# Altium project PCIE to MXM Riser Mini.PrjPcb
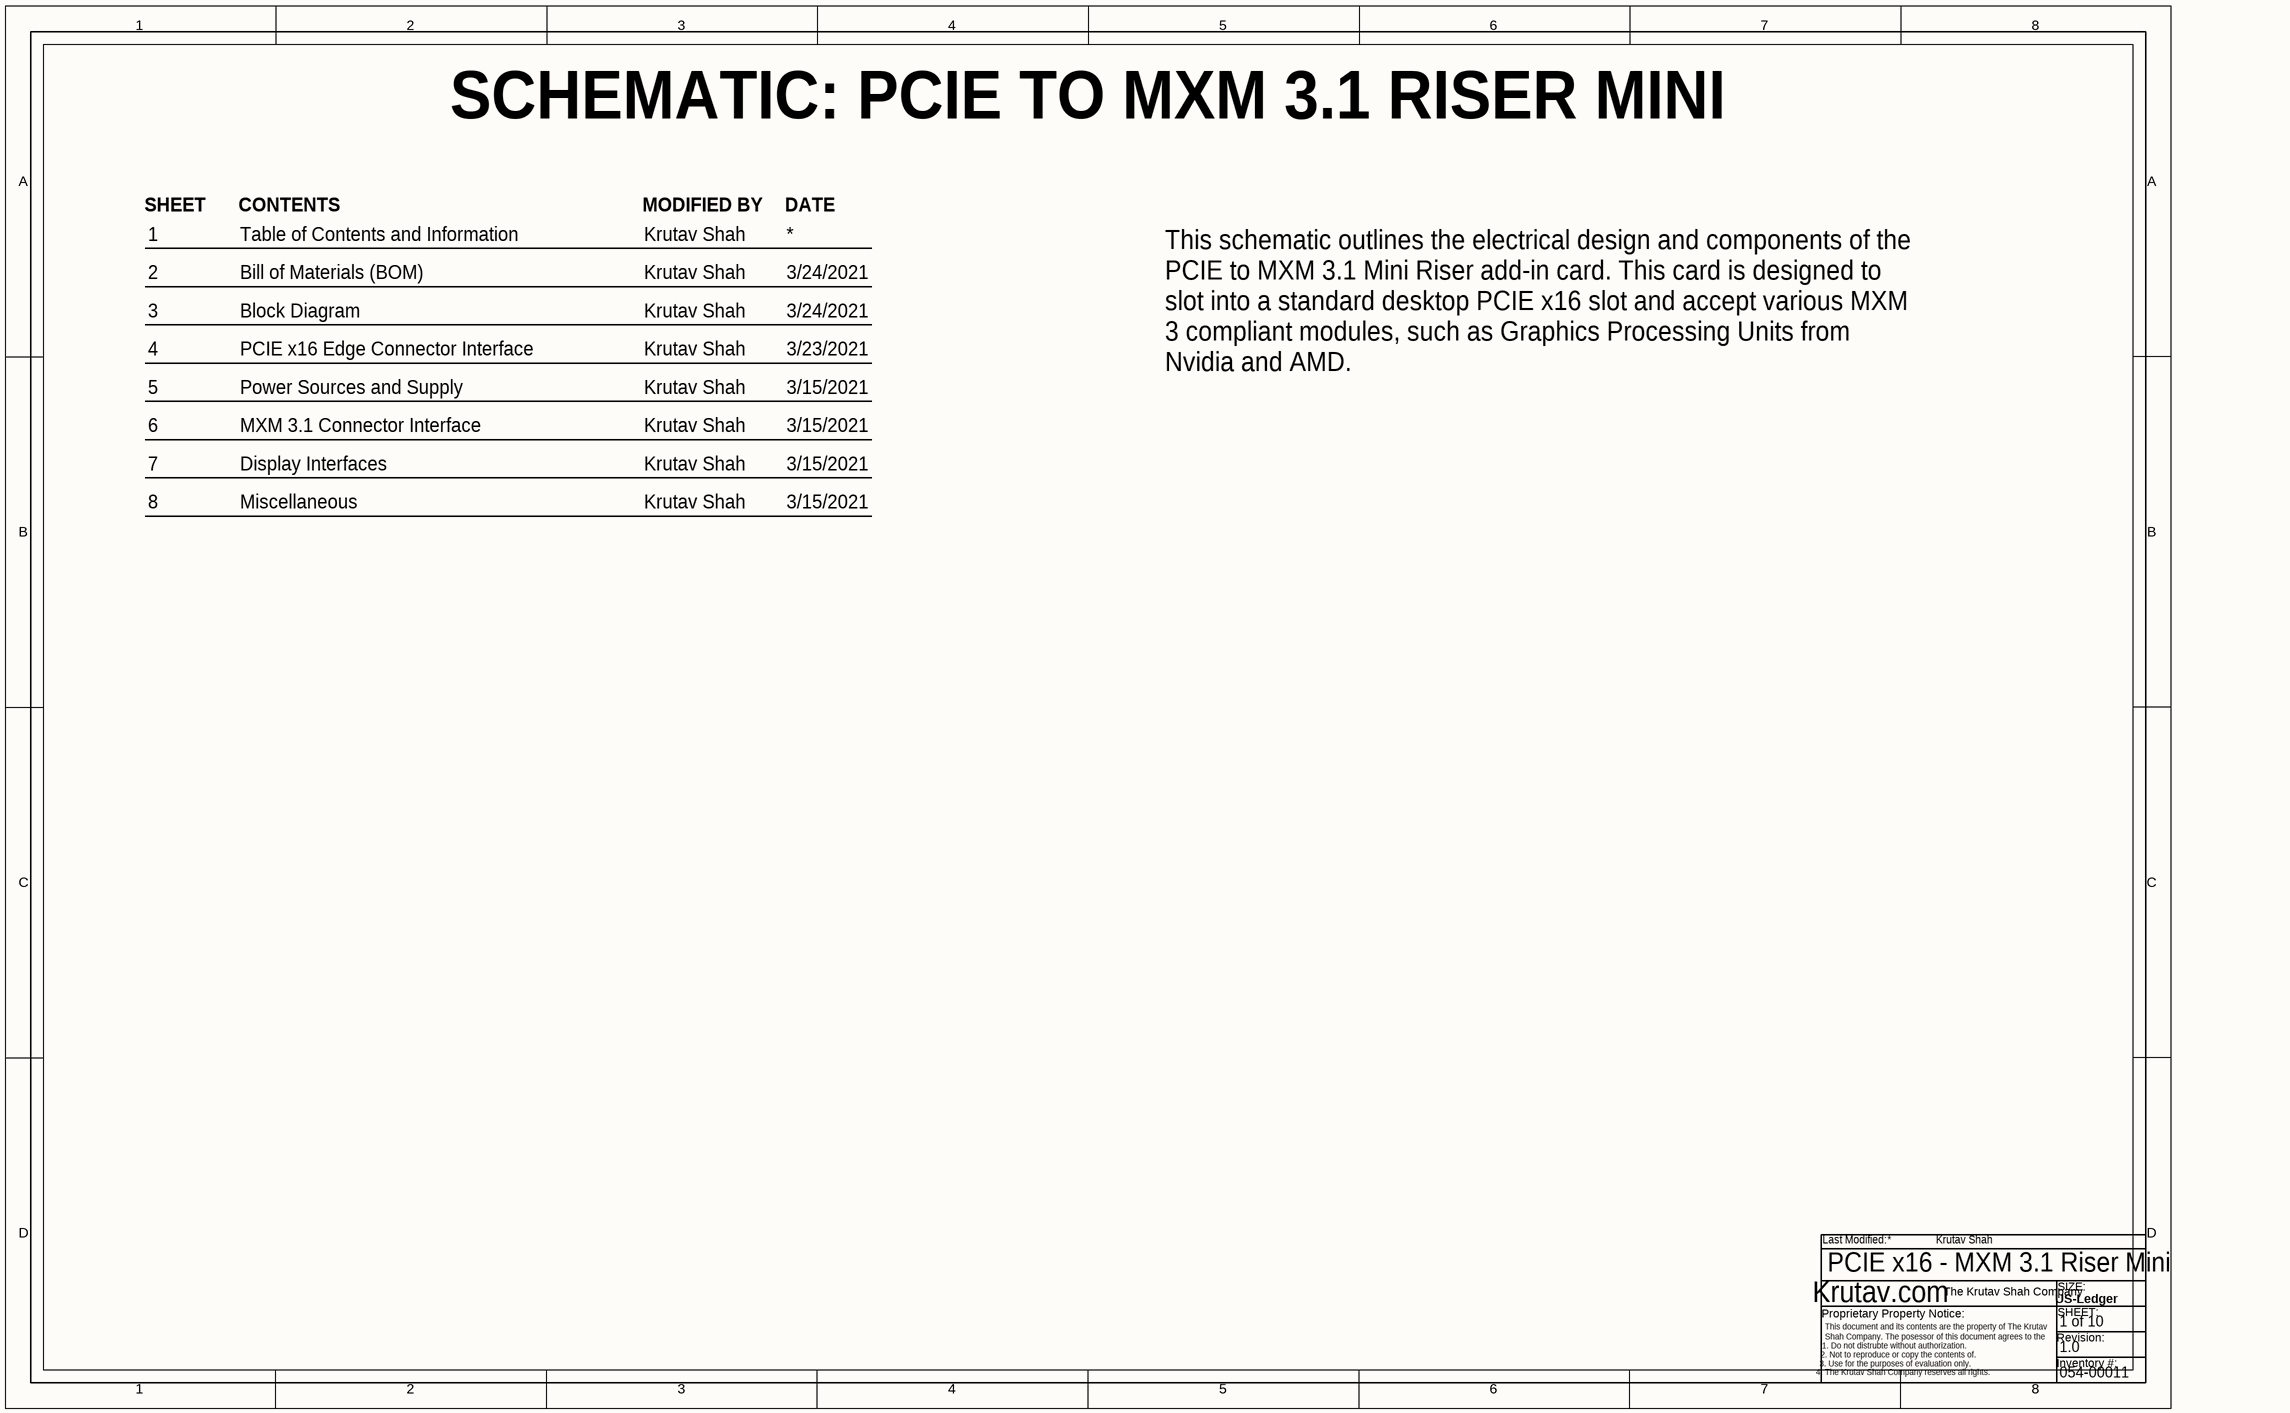
[diagram p0: Table of Contents and Information.SchDoc]
3 sheets, 33 parts. Net scope: hierarchical (ports join the sheet entries above them; power ports are global).
Board file: PCIE to MXM3.1 Riser Mini.PCBDOC
Sheets:
  Table of Contents and Information.SchDoc
  PCIE x16 Edge Connector Interface.SchDoc
  PCI Express_24130X11115_164PIN.schdoc

## Sheet Table of Contents and Information.SchDoc: Overview
size Tabloid; Author: Krutav Shah; DrawnBy: Krutav Shah; SheetNumber: 1; SheetTotal: 4

### Notes on the sheet
- SCHEMATIC: PCIE TO MXM 3.1 RISER MINI
- SHEET
- CONTENTS
- MODIFIED BY
- DATE
- 1
- 2
- Table of Contents and Information
- Bill of Materials (BOM)
- 3/24/2021
- 3
- Block Diagram
- 4
- 5
- PCIE x16 Edge Connector Interface
- Power Sources and Supply
- 3/23/2021
- 3/15/2021
- 6
- 7
- MXM 3.1 Connector Interface
- Display Interfaces
- 8
- Miscellaneous
- This schematic outlines the electrical design and components of the PCIE to MXM 3.1 Mini Riser add-in card. This card is designed to slot into a standard desktop PCIE x16 slot and accept various MXM 3 compliant modules, such as Graphics Processing Units from Nvidia and AMD.
- PCIE x16 - MXM 3.1 Riser Mini
- 1 of 10
- 1.0
- 054-00011
- Last Modified:
- Krutav.com
- The Krutav Shah Company
- SIZE:
- SHEET:
- US-Ledger
- This document and its contents are the property of The Krutav Shah Company. The posessor of this document agrees to the following:
- Proprietary Property Notice:
- 1. Do not distrubte without authorization.
- 3. Use for the purposes of evaluation only.
- 2. Not to reproduce or copy the contents of.
- 4. The Krutav Shah Company reserves all rights.
- Revision:
- Inventory #:

## Sheet PCIE x16 Edge Connector Interface.SchDoc
size Tabloid; DrawnBy: Krutav Shah; SheetNumber: 2; SheetTotal: 4
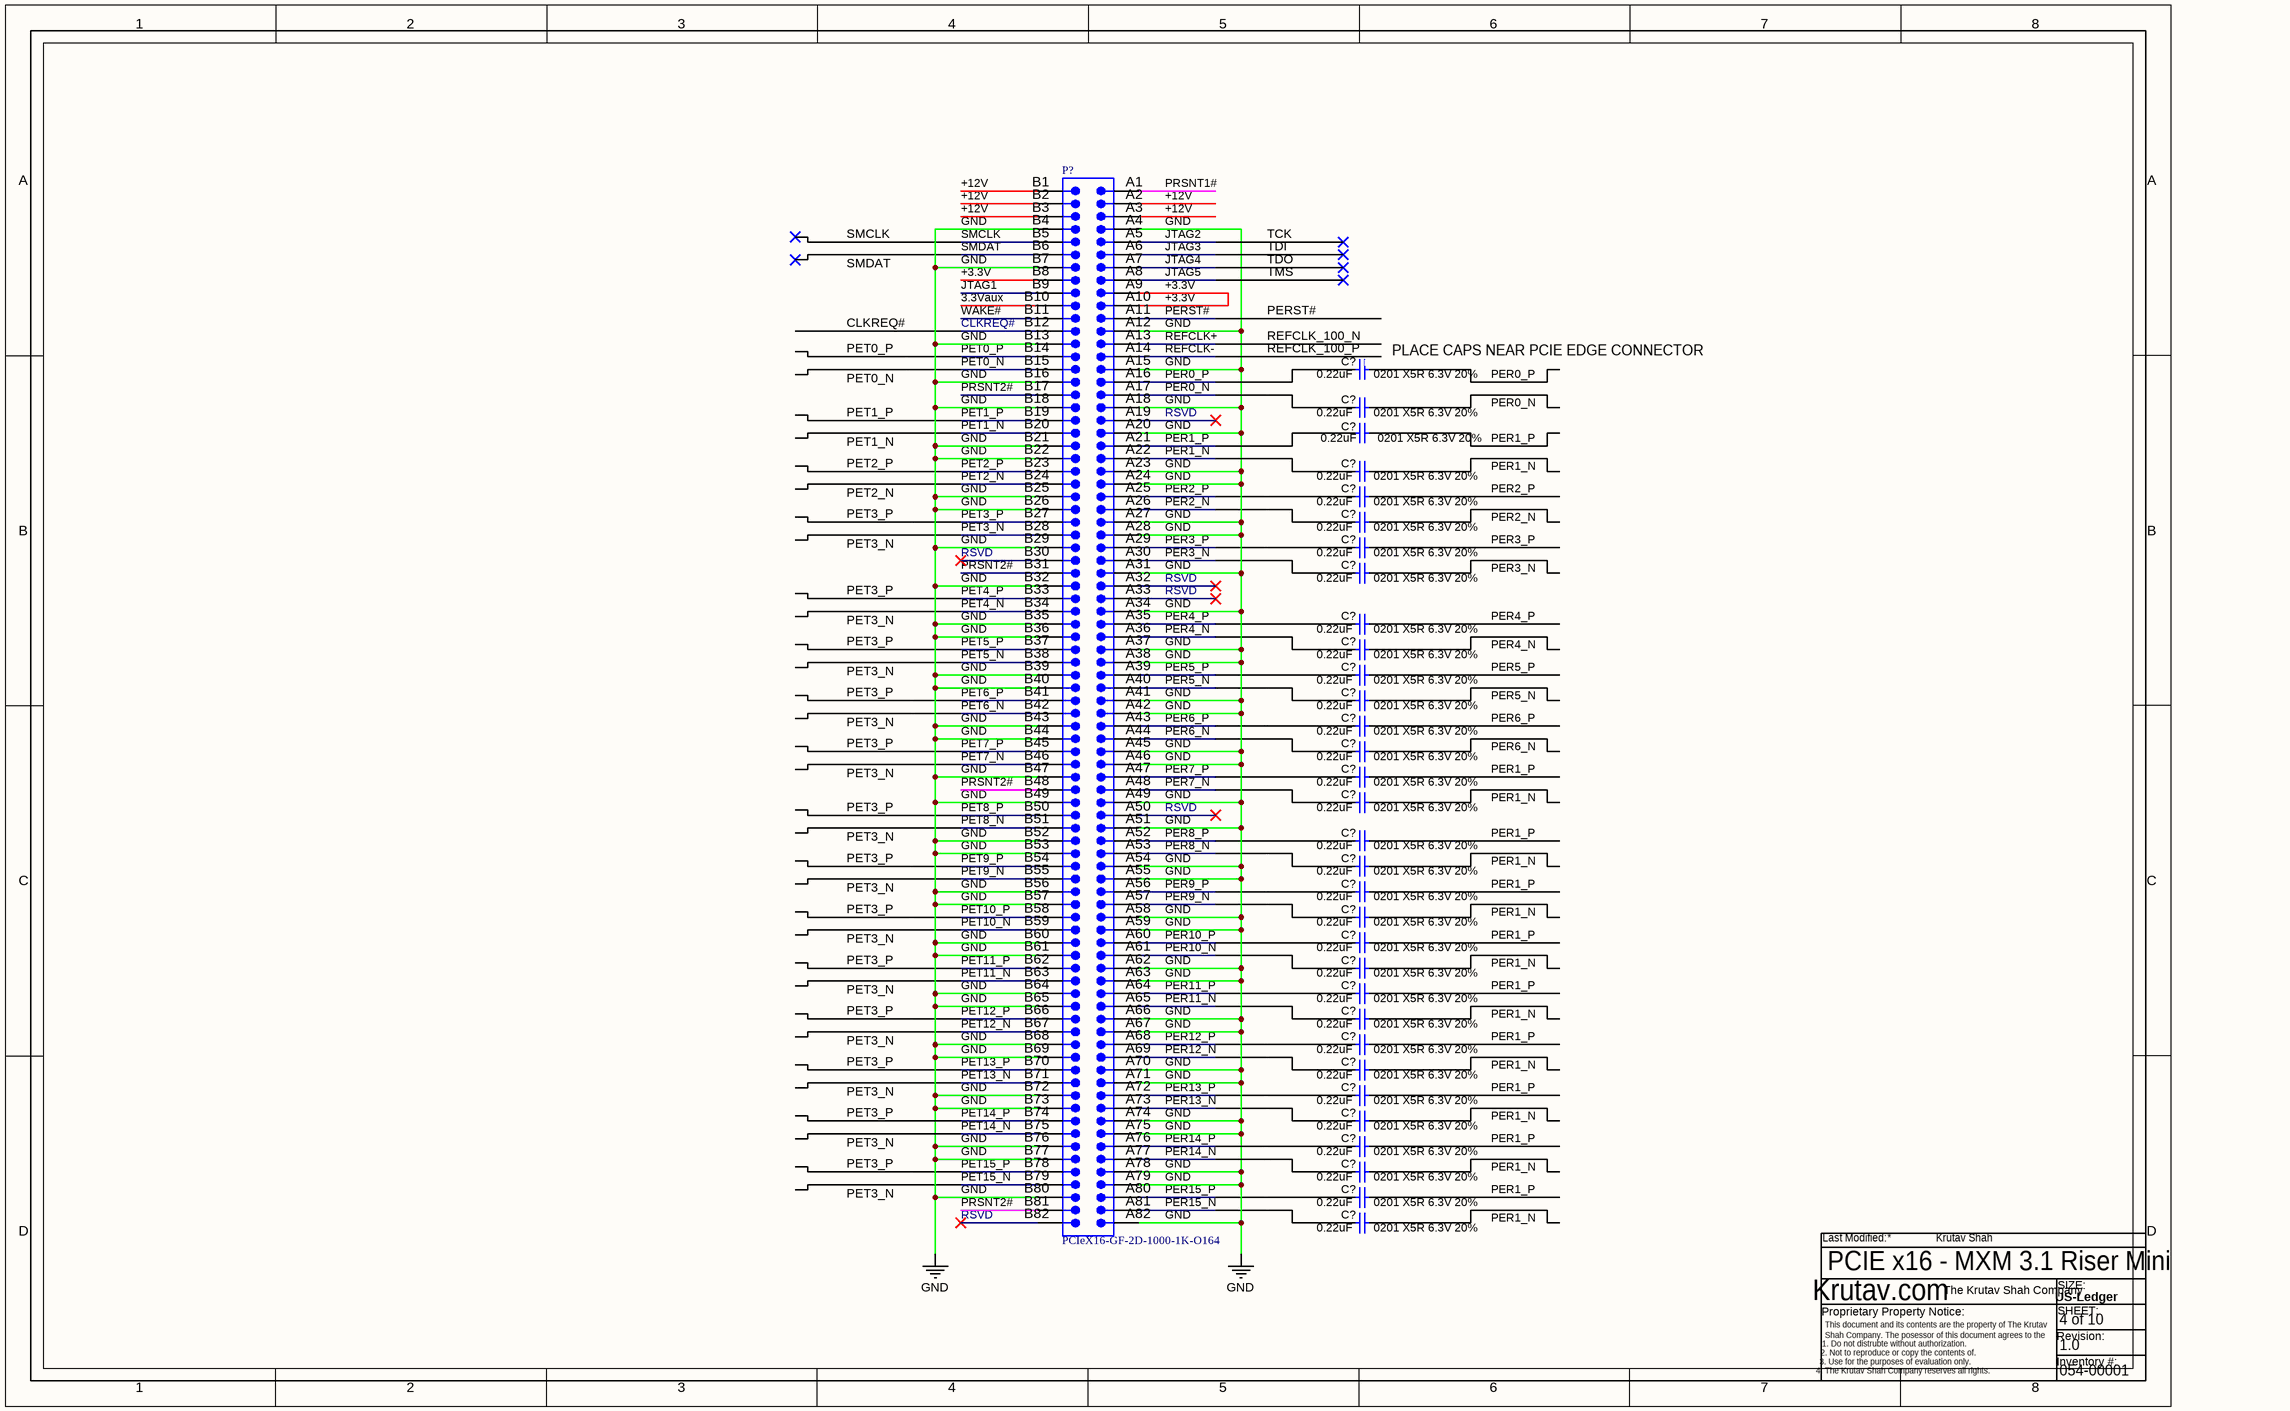
[diagram p1: PCIE x16 Edge Connector Interface.SchDoc]

### Parts
(Parts that share a designator on the sheet are numbered #1, #2 ... from top to bottom, then left to right.)
C?#1  0.22uF       0201 X5R 6.3V 20%  [CAPC0603X33X15NL03T05]
C?#2  0.22uF       0201 X5R 6.3V 20%  [CAPC0603X33X15NL03T05]
C?#3  0.22uF       0201 X5R 6.3V 20%  [CAPC0603X33X15NL03T05]
C?#4  0.22uF       0201 X5R 6.3V 20%  [CAPC0603X33X15NL03T05]
C?#5  0.22uF       0201 X5R 6.3V 20%  [CAPC0603X33X15NL03T05]
C?#6  0.22uF       0201 X5R 6.3V 20%  [CAPC0603X33X15NL03T05]
C?#7  0.22uF       0201 X5R 6.3V 20%  [CAPC0603X33X15NL03T05]
C?#8  0.22uF       0201 X5R 6.3V 20%  [CAPC0603X33X15NL03T05]
C?#9  0.22uF       0201 X5R 6.3V 20%  [CAPC0603X33X15NL03T05]
C?#10  0.22uF       0201 X5R 6.3V 20%  [CAPC0603X33X15NL03T05]
C?#11  0.22uF       0201 X5R 6.3V 20%  [CAPC0603X33X15NL03T05]
C?#12  0.22uF       0201 X5R 6.3V 20%  [CAPC0603X33X15NL03T05]
C?#13  0.22uF       0201 X5R 6.3V 20%  [CAPC0603X33X15NL03T05]
C?#14  0.22uF       0201 X5R 6.3V 20%  [CAPC0603X33X15NL03T05]
C?#15  0.22uF       0201 X5R 6.3V 20%  [CAPC0603X33X15NL03T05]
C?#16  0.22uF       0201 X5R 6.3V 20%  [CAPC0603X33X15NL03T05]
C?#17  0.22uF       0201 X5R 6.3V 20%  [CAPC0603X33X15NL03T05]
C?#18  0.22uF       0201 X5R 6.3V 20%  [CAPC0603X33X15NL03T05]
C?#19  0.22uF       0201 X5R 6.3V 20%  [CAPC0603X33X15NL03T05]
C?#20  0.22uF       0201 X5R 6.3V 20%  [CAPC0603X33X15NL03T05]
C?#21  0.22uF       0201 X5R 6.3V 20%  [CAPC0603X33X15NL03T05]
C?#22  0.22uF       0201 X5R 6.3V 20%  [CAPC0603X33X15NL03T05]
C?#23  0.22uF       0201 X5R 6.3V 20%  [CAPC0603X33X15NL03T05]
C?#24  0.22uF       0201 X5R 6.3V 20%  [CAPC0603X33X15NL03T05]
C?#25  0.22uF       0201 X5R 6.3V 20%  [CAPC0603X33X15NL03T05]
C?#26  0.22uF       0201 X5R 6.3V 20%  [CAPC0603X33X15NL03T05]
C?#27  0.22uF       0201 X5R 6.3V 20%  [CAPC0603X33X15NL03T05]
C?#28  0.22uF       0201 X5R 6.3V 20%  [CAPC0603X33X15NL03T05]
C?#29  0.22uF       0201 X5R 6.3V 20%  [CAPC0603X33X15NL03T05]
C?#30  0.22uF       0201 X5R 6.3V 20%  [CAPC0603X33X15NL03T05]
C?#31  0.22uF       0201 X5R 6.3V 20%  [CAPC0603X33X15NL03T05]
C?#32  0.22uF       0201 X5R 6.3V 20%  [CAPC0603X33X15NL03T05]
P?  PCIeX16-GF-2D-1000-1K-O164  [PCIeX16-GF-2D-1000-1K-O164]  (no BOM)

### Nets
GND: P?.A4 P?.A12 P?.A15 P?.A18 P?.A20 P?.A23 P?.A24 P?.A27 P?.A28 P?.A31 P?.A34 P?.A37 P?.A38 P?.A41 P?.A42 P?.A45 P?.A46 P?.A49 P?.A51 P?.A54 P?.A55 P?.A58 P?.A59 P?.A62 P?.A63 P?.A66 P?.A67 P?.A70 P?.A71 P?.A74 P?.A75 P?.A78 P?.A79 P?.A82 P?.B4 P?.B7 P?.B13 P?.B16 P?.B18 P?.B21 P?.B22 P?.B25 P?.B26 P?.B29 P?.B32 P?.B35 P?.B36 P?.B39 P?.B40 P?.B43 P?.B44 P?.B47 P?.B49 P?.B52 P?.B53 P?.B56 P?.B57 P?.B60 P?.B61 P?.B64 P?.B65 P?.B68 P?.B69 P?.B72 P?.B73 P?.B76 P?.B77 P?.B80
3.3Vaux: P?.B10
+3.3V: P?.A9 P?.A10 P?.B8
+12V: P?.A2 P?.A3 P?.B1 P?.B2 P?.B3
CLKREQ#: P?.B12
JTAG1: P?.B9
JTAG2: P?.A5  [also labelled TCK]
JTAG3: P?.A6  [also labelled TDI]
JTAG4: P?.A7  [also labelled TDO]
JTAG5: P?.A8  [also labelled TMS]
PER0_N: C?#2.1 C?#2.2 P?.A17
PER0_P: C?#1.1 C?#1.2 P?.A16
PER1_N: C?#4.1 C?#4.2 C?#16.2 C?#18.2 C?#20.2 C?#22.2 C?#24.2 C?#26.2 C?#28.2 C?#30.2 C?#32.2 P?.A22
PER1_P: C?#3.1 C?#3.2 C?#15.2 C?#17.2 C?#19.2 C?#21.2 C?#23.2 C?#25.2 C?#27.2 C?#29.2 C?#31.2 P?.A21
PER2_N: C?#6.1 C?#6.2 P?.A26
PER2_P: C?#5.1 C?#5.2 P?.A25
PER3_N: C?#8.1 C?#8.2 P?.A30
PER3_P: C?#7.1 C?#7.2 P?.A29
PER4_N: C?#10.1 C?#10.2 P?.A36
PER4_P: C?#9.1 C?#9.2 P?.A35
PER5_N: C?#12.1 C?#12.2 P?.A40
PER5_P: C?#11.1 C?#11.2 P?.A39
PER6_N: C?#14.1 C?#14.2 P?.A44
PER6_P: C?#13.1 C?#13.2 P?.A43
PER7_N: C?#16.1 P?.A48
PER7_P: C?#15.1 P?.A47
PER8_N: C?#18.1 P?.A53
PER8_P: C?#17.1 P?.A52
PER9_N: C?#20.1 P?.A57
PER9_P: C?#19.1 P?.A56
PER10_N: C?#22.1 P?.A61
PER10_P: C?#21.1 P?.A60
PER11_N: C?#24.1 P?.A65
PER11_P: C?#23.1 P?.A64
PER12_N: C?#26.1 P?.A69
PER12_P: C?#25.1 P?.A68
PER13_N: C?#28.1 P?.A73
PER13_P: C?#27.1 P?.A72
PER14_N: C?#30.1 P?.A77
PER14_P: C?#29.1 P?.A76
PER15_N: C?#32.1 P?.A81
PER15_P: C?#31.1 P?.A80
PERST#: P?.A11
PET0_N: P?.B15
PET0_P: P?.B14
PET1_N: P?.B20
PET1_P: P?.B19
PET2_N: P?.B24
PET2_P: P?.B23
PET10_N: P?.B28 P?.B34 P?.B38 P?.B42 P?.B46 P?.B51 P?.B55 P?.B59 P?.B63 P?.B67 P?.B71 P?.B75 P?.B79  [also labelled PET11_N, PET12_N, PET13_N, PET14_N, PET15_N, PET3_N, PET4_N, PET5_N, PET6_N, PET7_N, PET8_N, PET9_N]
PET10_P: P?.B27 P?.B33 P?.B37 P?.B41 P?.B45 P?.B50 P?.B54 P?.B58 P?.B62 P?.B66 P?.B70 P?.B74 P?.B78  [also labelled PET11_P, PET12_P, PET13_P, PET14_P, PET15_P, PET3_P, PET4_P, PET5_P, PET6_P, PET7_P, PET8_P, PET9_P]
PRSNT1#: P?.A1
PRSNT2#: P?.B17 P?.B31 P?.B48 P?.B81
REFCLK+: P?.A13  [also labelled REFCLK_100_N]
REFCLK-: P?.A14  [also labelled REFCLK_100_P]
SMCLK: P?.B5
SMDAT: P?.B6
WAKE#: P?.B11

Not connected (* = marked no-connect by the designer): P? A19* A32* A33* A50* B30* B82*

### Layout directives
differential pair: PER0_N, PER0_P, PER1_N, PER1_P, PER2_N, PER2_P, PER3_N, PER3_P, PER4_N, PER4_P, PER5_N, PER5_P, PER6_N, PER6_P, PER7_N, PER7_P, PER8_N, PER8_P, PER9_N, PER9_P, PER10_N, PER10_P, PER11_N, PER11_P, PER12_N, PER12_P, PER13_N, PER13_P, PER14_N, PER14_P, PER15_N, PER15_P, PET0_N, PET0_P, PET1_N, PET1_P, PET2_N, PET2_P, PET10_N, PET10_P, REFCLK+, REFCLK-

### Notes on the sheet
- CLKREQ#
- (near C?#1) PLACE CAPS NEAR PCIE EDGE CONNECTOR
- RSVD
- PCIE x16 - MXM 3.1 Riser Mini
- 4 of 10
- 1.0
- 054-00001
- Last Modified:
- Krutav.com
- The Krutav Shah Company
- SIZE:
- SHEET:
- US-Ledger
- This document and its contents are the property of The Krutav Shah Company. The posessor of this document agrees to the following:
- Proprietary Property Notice:
- 1. Do not distrubte without authorization.
- 3. Use for the purposes of evaluation only.
- 2. Not to reproduce or copy the contents of.
- 4. The Krutav Shah Company reserves all rights.
- Revision:
- Inventory #:

### Library data of the parts
C?#1-C?#32 = CMP-2010-00679-1: Manufacturer: Samsung; Part Number: CL03A224MQ3NNNC
P? = CMP-0001-00033-2: Golden finger, PCIeX16, Dual, Opposite, Pitch 1mm, 164-Position; Mating Connector: Molex-87715-9305; Package Reference: PCIeX16-GF-2D-1000-1K-O164; Publisher: Altium; Datasheet Version: rev2.0, Apr-2007; ClassName: Edge Connector

## Sheet PCI Express_24130X11115_164PIN.schdoc: PCI Express x16 Top Sheet
size A4; SheetNumber: 1; SheetTotal: 2
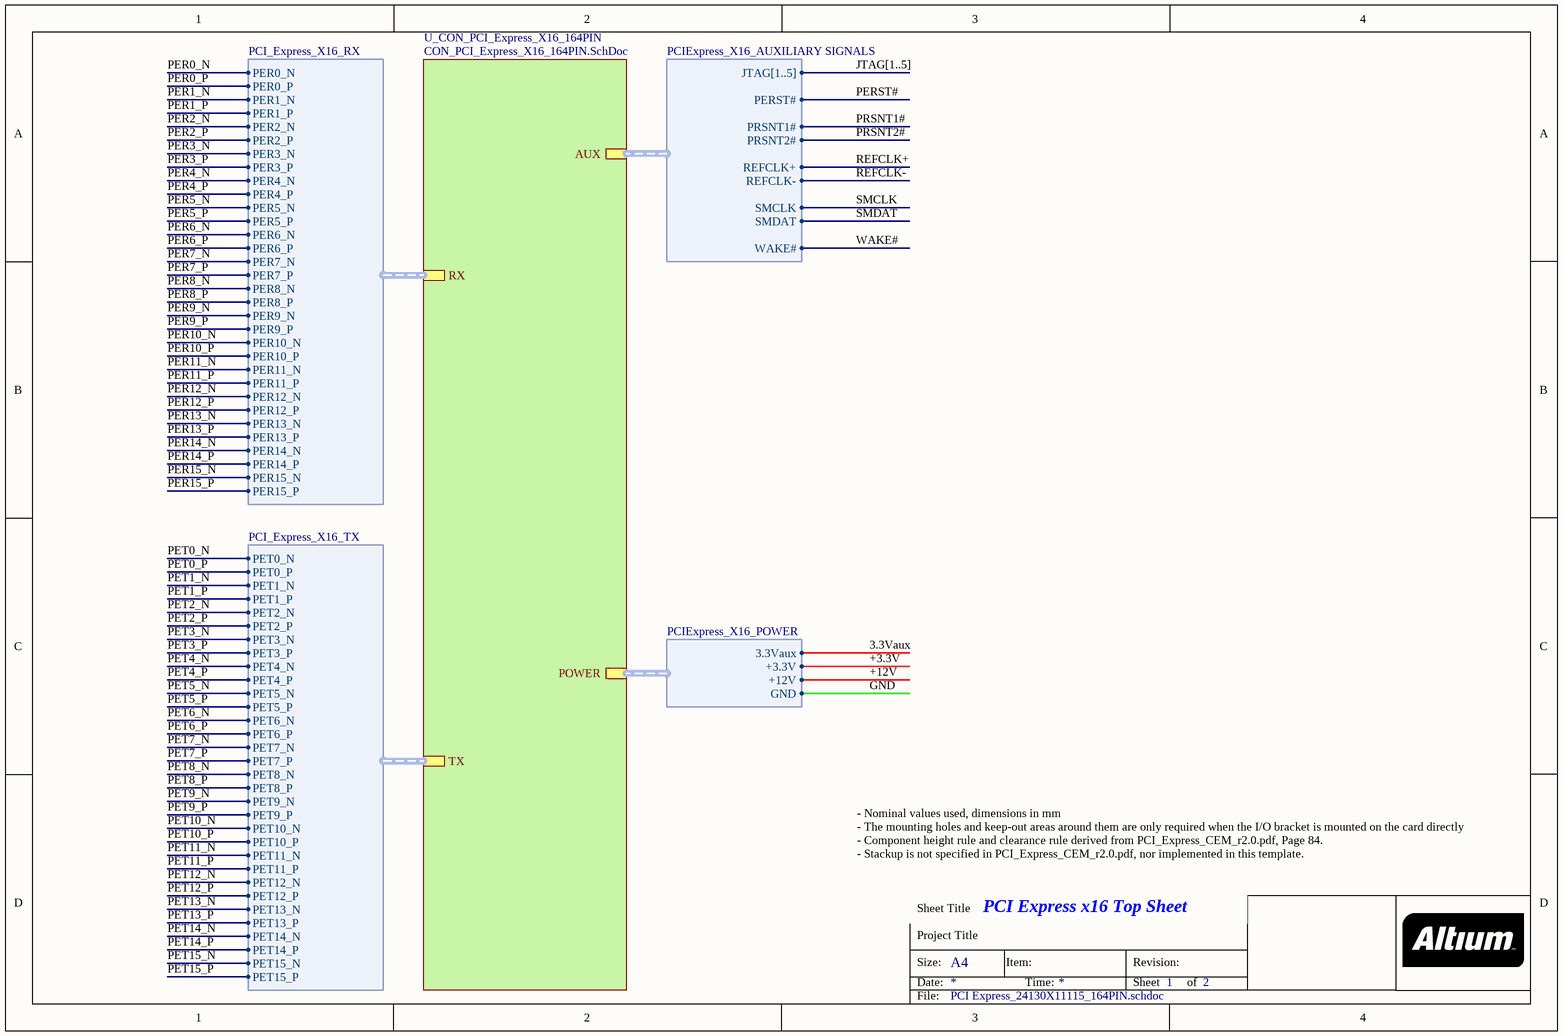
[diagram p2: PCI Express_24130X11115_164PIN.schdoc]

### Sub-sheets
U_CON_PCI_Express_X16_164PIN = CON_PCI_Express_X16_164PIN.SchDoc (file not in this document): POWER (harness PCIExpress_X16_POWER), AUX (harness PCIExpress_X16_AUXILIARY SIGNALS), TX (harness PCI_Express_X16_TX), RX (harness PCI_Express_X16_RX)

### Harnesses
PCI_Express_X16_RX: PER0_N, PER0_P, PER1_N, PER1_P, PER2_N, PER2_P, PER3_N, PER3_P, PER4_N, PER4_P, PER5_N, PER5_P, PER6_N, PER6_P, PER7_N, PER7_P, PER8_N, PER8_P, PER9_N, PER9_P, PER10_N, PER10_P, PER11_N, PER11_P, PER12_N, PER12_P, PER13_N, PER13_P, PER14_N, PER14_P, PER15_N, PER15_P
PCI_Express_X16_TX: PET0_N, PET0_P, PET1_N, PET1_P, PET2_N, PET2_P, PET3_N, PET3_P, PET4_N, PET4_P, PET5_N, PET5_P, PET6_N, PET6_P, PET7_N, PET7_P, PET8_N, PET8_P, PET9_N, PET9_P, PET10_N, PET10_P, PET11_N, PET11_P, PET12_N, PET12_P, PET13_N, PET13_P, PET14_N, PET14_P, PET15_N, PET15_P
PCIExpress_X16_POWER: +3.3V, +12V, GND, 3.3Vaux
PCIExpress_X16_AUXILIARY SIGNALS: JTAG[1..5], PERST#, PRSNT1#, PRSNT2#, REFCLK+, REFCLK-, SMCLK, SMDAT, WAKE#

### Nets
3.3Vaux: sheet U_CON_PCI_Express_X16_164PIN/POWER.3.3Vaux
+3.3V: sheet U_CON_PCI_Express_X16_164PIN/POWER.+3.3V
+12V: sheet U_CON_PCI_Express_X16_164PIN/POWER.+12V
GND: sheet U_CON_PCI_Express_X16_164PIN/POWER.GND
PER0_N: sheet U_CON_PCI_Express_X16_164PIN/RX.PER0_N
PER0_P: sheet U_CON_PCI_Express_X16_164PIN/RX.PER0_P
PER1_N: sheet U_CON_PCI_Express_X16_164PIN/RX.PER1_N
PER1_P: sheet U_CON_PCI_Express_X16_164PIN/RX.PER1_P
PER2_N: sheet U_CON_PCI_Express_X16_164PIN/RX.PER2_N
PER2_P: sheet U_CON_PCI_Express_X16_164PIN/RX.PER2_P
PER3_N: sheet U_CON_PCI_Express_X16_164PIN/RX.PER3_N
PER3_P: sheet U_CON_PCI_Express_X16_164PIN/RX.PER3_P
PER4_N: sheet U_CON_PCI_Express_X16_164PIN/RX.PER4_N
PER4_P: sheet U_CON_PCI_Express_X16_164PIN/RX.PER4_P
PER5_N: sheet U_CON_PCI_Express_X16_164PIN/RX.PER5_N
PER5_P: sheet U_CON_PCI_Express_X16_164PIN/RX.PER5_P
PER6_N: sheet U_CON_PCI_Express_X16_164PIN/RX.PER6_N
PER6_P: sheet U_CON_PCI_Express_X16_164PIN/RX.PER6_P
PER7_N: sheet U_CON_PCI_Express_X16_164PIN/RX.PER7_N
PER7_P: sheet U_CON_PCI_Express_X16_164PIN/RX.PER7_P
PER8_N: sheet U_CON_PCI_Express_X16_164PIN/RX.PER8_N
PER8_P: sheet U_CON_PCI_Express_X16_164PIN/RX.PER8_P
PER9_N: sheet U_CON_PCI_Express_X16_164PIN/RX.PER9_N
PER9_P: sheet U_CON_PCI_Express_X16_164PIN/RX.PER9_P
PER10_N: sheet U_CON_PCI_Express_X16_164PIN/RX.PER10_N
PER10_P: sheet U_CON_PCI_Express_X16_164PIN/RX.PER10_P
PER11_N: sheet U_CON_PCI_Express_X16_164PIN/RX.PER11_N
PER11_P: sheet U_CON_PCI_Express_X16_164PIN/RX.PER11_P
PER12_N: sheet U_CON_PCI_Express_X16_164PIN/RX.PER12_N
PER12_P: sheet U_CON_PCI_Express_X16_164PIN/RX.PER12_P
PER13_N: sheet U_CON_PCI_Express_X16_164PIN/RX.PER13_N
PER13_P: sheet U_CON_PCI_Express_X16_164PIN/RX.PER13_P
PER14_N: sheet U_CON_PCI_Express_X16_164PIN/RX.PER14_N
PER14_P: sheet U_CON_PCI_Express_X16_164PIN/RX.PER14_P
PER15_N: sheet U_CON_PCI_Express_X16_164PIN/RX.PER15_N
PER15_P: sheet U_CON_PCI_Express_X16_164PIN/RX.PER15_P
PERST#: sheet U_CON_PCI_Express_X16_164PIN/AUX.PERST#
PET0_N: sheet U_CON_PCI_Express_X16_164PIN/TX.PET0_N
PET0_P: sheet U_CON_PCI_Express_X16_164PIN/TX.PET0_P
PET1_N: sheet U_CON_PCI_Express_X16_164PIN/TX.PET1_N
PET1_P: sheet U_CON_PCI_Express_X16_164PIN/TX.PET1_P
PET2_N: sheet U_CON_PCI_Express_X16_164PIN/TX.PET2_N
PET2_P: sheet U_CON_PCI_Express_X16_164PIN/TX.PET2_P
PET3_N: sheet U_CON_PCI_Express_X16_164PIN/TX.PET3_N
PET3_P: sheet U_CON_PCI_Express_X16_164PIN/TX.PET3_P
PET4_N: sheet U_CON_PCI_Express_X16_164PIN/TX.PET4_N
PET4_P: sheet U_CON_PCI_Express_X16_164PIN/TX.PET4_P
PET5_N: sheet U_CON_PCI_Express_X16_164PIN/TX.PET5_N
PET5_P: sheet U_CON_PCI_Express_X16_164PIN/TX.PET5_P
PET6_N: sheet U_CON_PCI_Express_X16_164PIN/TX.PET6_N
PET6_P: sheet U_CON_PCI_Express_X16_164PIN/TX.PET6_P
PET7_N: sheet U_CON_PCI_Express_X16_164PIN/TX.PET7_N
PET7_P: sheet U_CON_PCI_Express_X16_164PIN/TX.PET7_P
PET8_N: sheet U_CON_PCI_Express_X16_164PIN/TX.PET8_N
PET8_P: sheet U_CON_PCI_Express_X16_164PIN/TX.PET8_P
PET9_N: sheet U_CON_PCI_Express_X16_164PIN/TX.PET9_N
PET9_P: sheet U_CON_PCI_Express_X16_164PIN/TX.PET9_P
PET10_N: sheet U_CON_PCI_Express_X16_164PIN/TX.PET10_N
PET10_P: sheet U_CON_PCI_Express_X16_164PIN/TX.PET10_P
PET11_N: sheet U_CON_PCI_Express_X16_164PIN/TX.PET11_N
PET11_P: sheet U_CON_PCI_Express_X16_164PIN/TX.PET11_P
PET12_N: sheet U_CON_PCI_Express_X16_164PIN/TX.PET12_N
PET12_P: sheet U_CON_PCI_Express_X16_164PIN/TX.PET12_P
PET13_N: sheet U_CON_PCI_Express_X16_164PIN/TX.PET13_N
PET13_P: sheet U_CON_PCI_Express_X16_164PIN/TX.PET13_P
PET14_N: sheet U_CON_PCI_Express_X16_164PIN/TX.PET14_N
PET14_P: sheet U_CON_PCI_Express_X16_164PIN/TX.PET14_P
PET15_N: sheet U_CON_PCI_Express_X16_164PIN/TX.PET15_N
PET15_P: sheet U_CON_PCI_Express_X16_164PIN/TX.PET15_P
PRSNT1#: sheet U_CON_PCI_Express_X16_164PIN/AUX.PRSNT1#
PRSNT2#: sheet U_CON_PCI_Express_X16_164PIN/AUX.PRSNT2#
REFCLK+: sheet U_CON_PCI_Express_X16_164PIN/AUX.REFCLK+
REFCLK-: sheet U_CON_PCI_Express_X16_164PIN/AUX.REFCLK-
SMCLK: sheet U_CON_PCI_Express_X16_164PIN/AUX.SMCLK
SMDAT: sheet U_CON_PCI_Express_X16_164PIN/AUX.SMDAT
WAKE#: sheet U_CON_PCI_Express_X16_164PIN/AUX.WAKE#

### Buses and harness runs
bus JTAG[1..5]

### Notes on the sheet
- - Nominal values used, dimensions in mm
  - The mounting holes and keep-out areas around them are only required when the I/O bracket is mounted on the card directly
  - Component height rule and clearance rule derived from PCI_Express_CEM_r2.0.pdf, Page 84.
  - Stackup is not specified in PCI_Express_CEM_r2.0.pdf, nor implemented in this template.
- Sheet Title
- Project Title
- Size:
- Date:
- A4
- Item:
- Time:
- Revision:
- Sheet
- of
- File: